# EAGLE design pico-pcm-cardem (EAGLE 7.7.0)
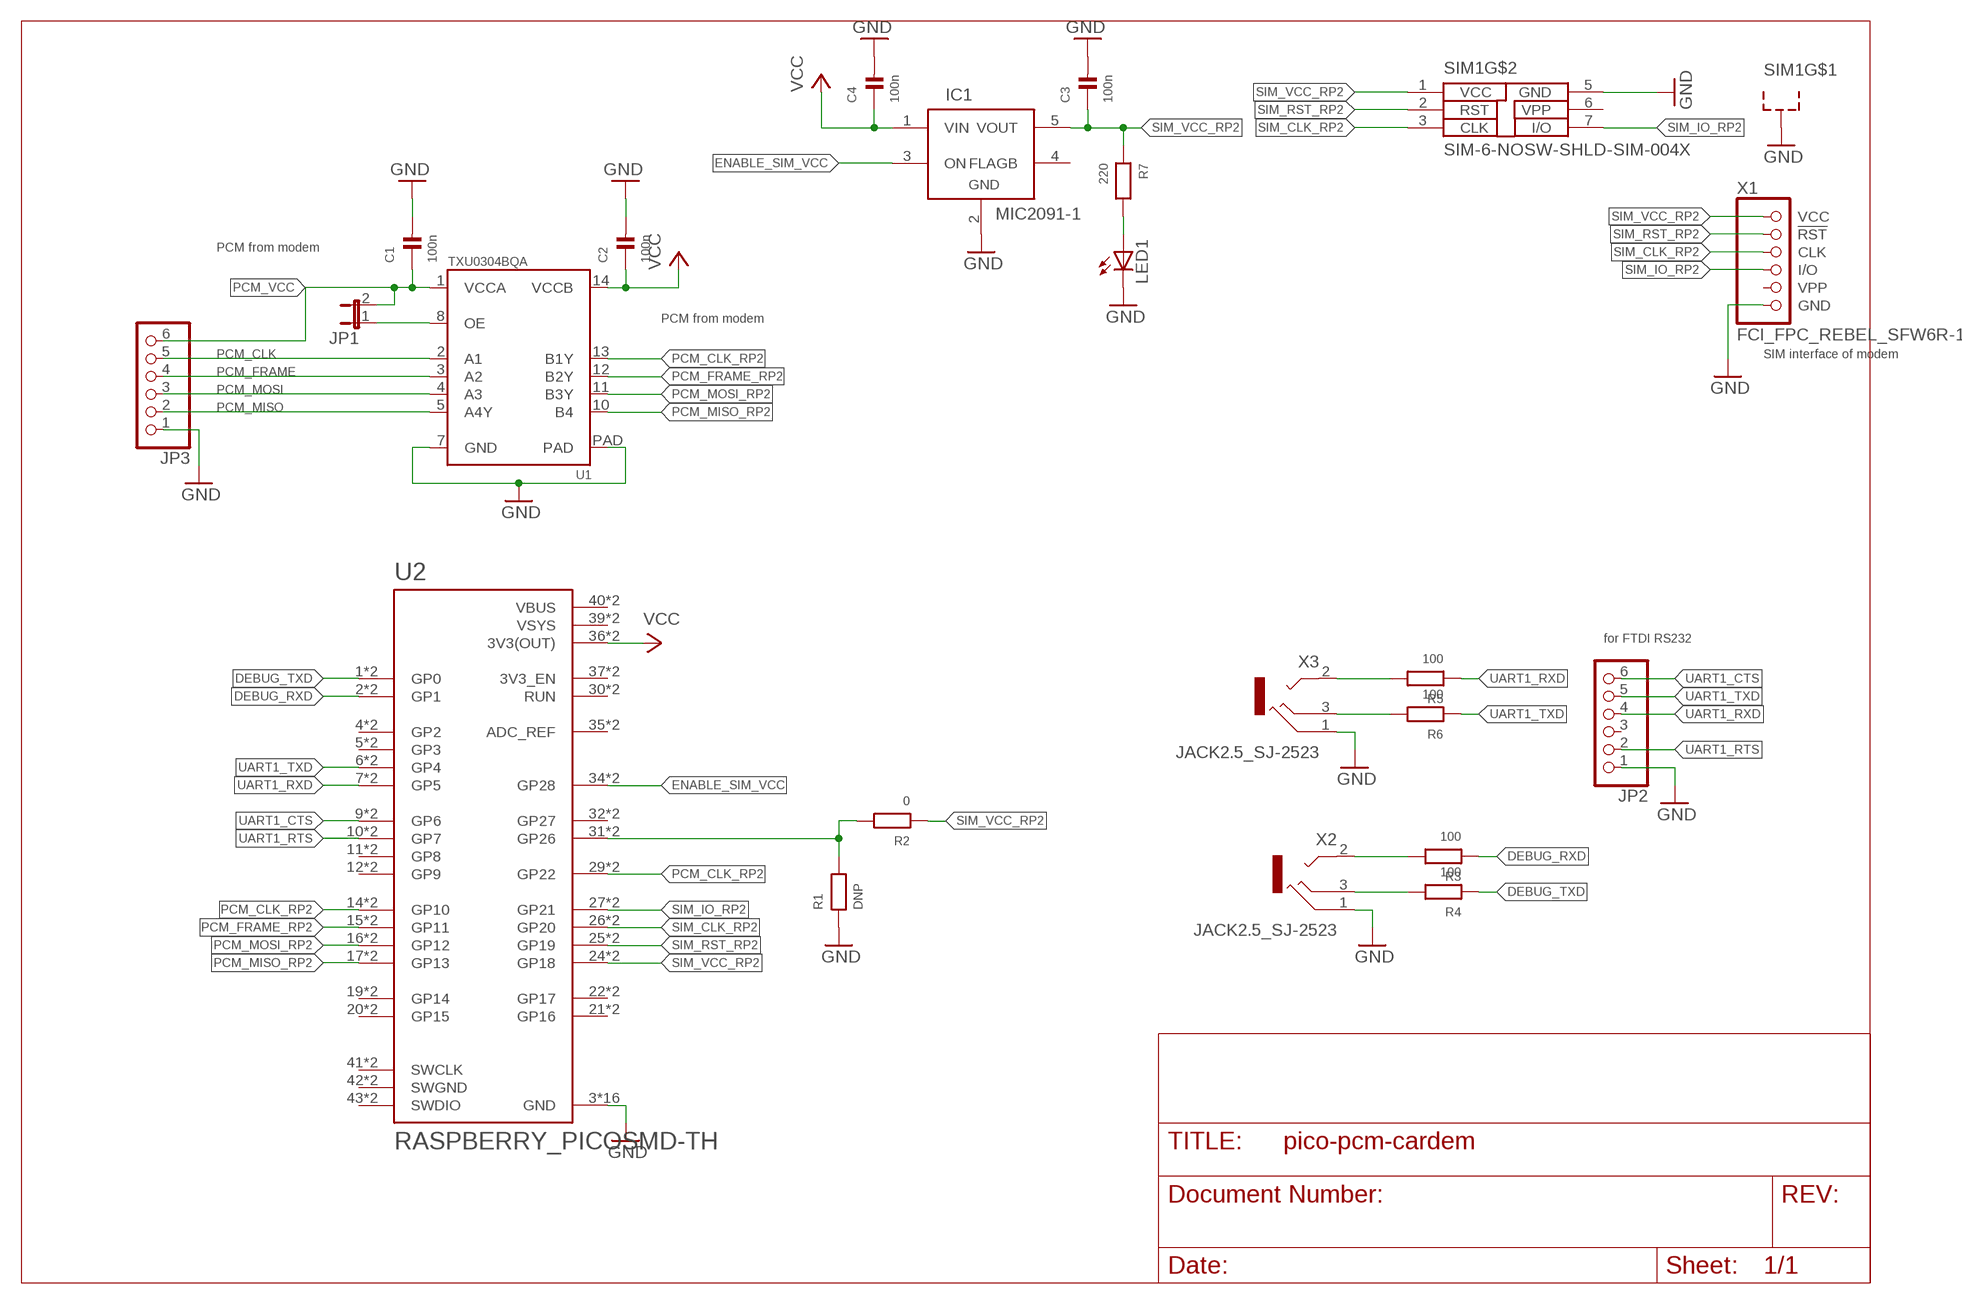
[diagram p0: schematic, sheet 1]

## Parts
C1  100n  CAP_CERAMIC_0603  [_0603]
C2  100n  CAP_CERAMIC_0603  [_0603]
C3  100n  CAP_CERAMIC_0603  [_0603]
C4  100n  CAP_CERAMIC_0603  [_0603]
IC1  MIC2091-1  FPF210X  [SOT23-5]
JP1  JP1E  [JP1]
JP2  PINHD-1X6  [1X06]
JP3  PINHD-1X6  [1X06]
LED1  LEDCHIP-LED0603  [CHIP-LED0603]
R1  DNP  RESISTOR_0603  [_0603]
R2  0  RESISTOR_0603  [_0603]
R3  100  RESISTOR_0603  [_0603]
R4  100  RESISTOR_0603  [_0603]
R5  100  RESISTOR_0603  [_0603]
R6  100  RESISTOR_0603  [_0603]
R7  220  RESISTOR_0603  [_0603]
SIM1  SIM-6-NOSW-SHLD-SIM-004X  [SOFNG_SIM-004X]
U1  TXU0304BQA  [14WQFN]
U2  RASPBERRY_PICOSMD-TH  [PICO-PKG]
X1  FCI_FPC_REBEL_SFW6R-1  [FPC_REBEL_SFW6R-1ST]
X2  JACK2.5_SJ-2523  [JACK2.5_SJ-2523]
X3  JACK2.5_SJ-2523  [JACK2.5_SJ-2523]

## Nets
DEBUG_RXD: R3.1 U2.2(GP1) U2.P$2(GP1)
DEBUG_TXD: R4.1 U2.1(GP0) U2.P$1(GP0)
ENABLE_SIM_VCC: IC1.3(ON) U2.34(GP28) U2.P$34(GP28)
GND: C1.2 C2.2 C3.2 C4.2 IC1.2(GND) JP2.1 JP3.1 LED1.C R1.1 SIM1.5(GND) SIM1.SHLD1(SHLD) SIM1.SHLD2(SHLD) SIM1.SHLD3(SHLD) SIM1.SHLD4(SHLD) U1.7(GND) U1.PAD U2.3(GND) U2.8(GND) U2.13(GND) U2.18(GND) U2.23(GND) U2.28(GND) U2.33(GND) U2.38(GND) U2.P$3(GND) U2.P$8(GND) U2.P$13(GND) U2.P$18(GND) U2.P$23(GND) U2.P$28(GND) U2.P$33(GND) U2.P$38(GND) X1.6(GND) X2.1(RING) X3.1(RING)
N$1: R3.2 X2.2(TIP)
N$2: JP1.1 U1.8(OE)
N$3: R1.2 R2.2 U2.31(GP26) U2.P$31(GP26)
N$4: R4.2 X2.3(MIDDLE)
N$5: R5.2 X3.2(TIP)
N$6: R6.2 X3.3(MIDDLE)
N$7: LED1.A R7.2
PCM_CLK: JP3.5 U1.2(A1)
PCM_CLK_RP2: U1.13(B1Y) U2.14(GP10) U2.29(GP22) U2.P$14(GP10) U2.P$29(GP22)
PCM_FRAME: JP3.4 U1.3(A2)
PCM_FRAME_RP2: U1.12(B2Y) U2.15(GP11) U2.P$15(GP11)
PCM_MISO: JP3.2 U1.5(A4Y)
PCM_MISO_RP2: U1.10(B4) U2.17(GP13) U2.P$17(GP13)
PCM_MOSI: JP3.3 U1.4(A3)
PCM_MOSI_RP2: U1.11(B3Y) U2.16(GP12) U2.P$16(GP12)
PCM_VCC: C1.1 JP1.2 JP3.6 U1.1(VCCA)
SIM_CLK_RP2: SIM1.3(CLK) U2.26(GP20) U2.P$26(GP20) X1.3(CLK)
SIM_IO_RP2: SIM1.7(I/O) U2.27(GP21) U2.P$27(GP21) X1.4(I/O)
SIM_RST_RP2: SIM1.2(RST) U2.25(GP19) U2.P$25(GP19) X1.2(!RST)
SIM_VCC_RP2: C3.1 IC1.5(VOUT) R2.1 R7.1 SIM1.1(VCC) U2.24(GP18) U2.P$24(GP18) X1.1(VCC)
UART1_CTS: JP2.6 U2.9(GP6) U2.P$9(GP6)
UART1_RTS: JP2.2 U2.10(GP7) U2.P$10(GP7)
UART1_RXD: JP2.4 R5.1 U2.7(GP5) U2.P$7(GP5)
UART1_TXD: JP2.5 R6.1 U2.6(GP4) U2.P$6(GP4)
VCC: C2.1 C4.1 IC1.1(VIN) U1.14(VCCB) U2.36(3V3(OUT)) U2.P$36(3V3(OUT))
Unconnected: IC1.4(FLAGB) JP2.3 U2.4(GP2) U2.5(GP3) U2.11(GP8) U2.12(GP9) U2.19(GP14) U2.20(GP15) U2.21(GP16) U2.22(GP17) U2.30(RUN) U2.32(GP27) U2.35(ADC_REF) U2.37(3V3_EN) U2.41(SWCLK) U2.43(SWDIO) U2.P$4(GP2) U2.P$5(GP3) U2.P$11(GP8) U2.P$12(GP9) U2.P$19(GP14) U2.P$20(GP15) U2.P$21(GP16) U2.P$22(GP17) U2.P$30(RUN) U2.P$32(GP27) U2.P$35(ADC_REF) U2.P$37(3V3_EN) U2.P$41(SWCLK) U2.P$43(SWDIO)

## Notes on the sheet
- PCM from modem
- PCM from modem
- SIM interface of modem
- for FTDI RS232

## Power pins joined to a net without a drawn wire
SWGND: U2.42(SWGND) U2.P$42(SWGND)
VBUS: U2.40(VBUS) U2.P$40(VBUS)
VPP: SIM1.6(VPP) X1.5(VPP)
VSYS: U2.39(VSYS) U2.P$39(VSYS)

## Library data of the parts
C1-C4 = rc-sysmocom:CAP_CERAMIC: Ceramic Capacitors 0402 - 0402 Surface Mount Capacitors 16pF 50V 5% [Digikey: 445-4899-2-ND] 18pF 50V 5% [Digikey: 490-1281-2-ND] 22pF 50V 5% [Digikey: 490-1283-2-ND] 68pF 50V 5% [Digikey: 490-1289-2-ND] 0.1uF 10V 10% [Digikey: 490-1318-2-ND] 1.0uF 6.3V 10% [Digikey: 490-1320-2-ND] 0603 - 0603 Surface Mount Capacitors 16 pF 50V 5% [Digikey: 445-5051-2-ND] 22 pF 50V [Digikey: PCC220ACVTR-ND] 33 pF 50V 5% [Digikey: 490-1415-1-ND] 56pF 50V 5% [Digikey: 490-1421-1-ND] 220pF 50V 5% [Digikey: 445-1285-1-ND] 680 pF 50V 2200 pF 50V 5% C0G [Digikey: 445-1297-1-ND] 5600 pF 100V 5% X7R [Digikey: 478-3711-1-ND] 0.1 µF 25V 10% [Digikey: PCC2277TR-ND] 0.22 µF 16V 10% X7R [Digikey: 445-1318-1-ND] 1.0 µF 25V 10% [Digikey: 445-5146-2-ND] 0603 - RF Specific 3pF 250V +/-0.1pF RF [Digikey: 712-1347-1-ND] 18 pF 250V 5% [Digikey: 478-3505-1-ND or 712-1322-1-ND] 56 pF 250V 5% C0G RF [Digikey: 490-4867-1-ND] 68 pF 250V RF [Digikey: 490-4868-1-ND] 0805 - 0805 Surface Mount Capacitors 220 pF 250V 2% RF Ceramic Capacitor [Digikey: 712-1398-1-ND] 1000 pF 50V 2% NP0 Ceramic Capacitor [Digikey: 478-3760-1-ND] 0.1 µF 25V 10% Ceramic Capacitor [Digikey: PCC1828TR-ND] 1.0 µF 16V 10% Ceramic Capacitor[Digikey: 490-1691-2-ND] 10.0 µF 10V 10% Ceramic Capacitor[Digikey: 709-1228-1-ND] 10.0 uF 16V 10% Ceramic Capacitor [Digikey: 478-5165-2-ND] 47 uF 6.3V 20% Ceramic Capacitor [Digikey: 587-1779-1-ND or 399-5506-1-ND] 1206 - 1206 Surface Mount Capacitors 47uF 10V 20% Ceramic Capacitor [Digikey: 490-5528-1-ND or 399-5508-1-ND or 445-6010-1-ND] 100uF 6.3V -20%, +80% Y5V Ceramic Capacitor (Digikey: 490-4512-1-ND, Mouser: 81-GRM31CF50J107ZE1L) 1810 - 1810 Surface Mount Capacitors High volt MLC; no solder stop between for higher isolation; CLASS: CAPACITOR; DESCRIPTION: NO DESCRIPTION; LINK: UNKNOWN LINK; MANUFACTURER: UNKNOWN MANUFACTURER; MANUFACTURERPARTNUMBER: UNKNOWN MANUFACTURER PART NUMBER; POPULATED: TRUE; ROHSCERTIFICATE: UNKNOWN ROHS CERTIFICATE; SOURCE: UNKNOWN SOURCE; SOURCEPARTNUMBER: UNKNOWN SOURCE PART NUMBER
IC1 = FPF2x0x:FPF210X: FPF2100-FPF2107 IntelliMAX Advanced Load Management Products; CLASS: UNKNOWN CLASS; DESCRIPTION: NO DESCRIPTION; LINK: https://www.digikey.de/en/products/detail/microchip-technology/MIC2091-1YM5-TR/2650461; MANUFACTURER: UNKNOWN MANUFACTURER; MANUFACTURERPARTNUMBER: https://www.digikey.de/en/products/detail/microchip-technology/MIC2091-1YM5-TR/2650461; POPULATED: TRUE; ROHSCERTIFICATE: UNKNOWN ROHS CERTIFICATE; SOURCE: UNKNOWN SOURCE; SOURCEPARTNUMBER: 576-3891-1-ND
JP1 = jumper:JP1E: JUMPER; CLASS: CONNECTOR\JUMPER; DESCRIPTION: NO DESCRIPTION; LINK: UNKNOWN LINK; MANUFACTURER: UNKNOWN MANUFACTURER; MANUFACTURERPARTNUMBER: UNKNOWN MANUFACTURER PART NUMBER; POPULATED: TRUE; ROHSCERTIFICATE: UNKNOWN ROHS CERTIFICATE; SOURCE: UNKNOWN SOURCE; SOURCEPARTNUMBER: UNKNOWN SOURCE PART NUMBER
JP2 JP3 = pinhead:PINHD-1X6: PIN HEADER; CLASS: CONNECTOR\JUMPER; DESCRIPTION: NO DESCRIPTION; LINK: UNKNOWN LINK; MANUFACTURER: UNKNOWN MANUFACTURER; MANUFACTURERPARTNUMBER: UNKNOWN MANUFACTURER PART NUMBER; POPULATED: TRUE; ROHSCERTIFICATE: UNKNOWN ROHS CERTIFICATE; SOURCE: UNKNOWN SOURCE; SOURCEPARTNUMBER: UNKNOWN SOURCE PART NUMBER
LED1 = led:LED: LED OSRAM: - CHIPLED LG R971, LG N971, LY N971, LG Q971, LY Q971, LO R971, LY R971 LH N974, LH R974 LS Q976, LO Q976, LY Q976 LO Q996 - Hyper CHIPLED LW Q18S LB Q993, LB Q99A, LB R99A - SideLED LS A670, LO A670, LY A670, LG A670, LP A670 LB A673, LV A673, LT A673, LW A673 LH A674 LY A675 LS A676, LA A676, LO A676, LY A676, LW A676 LS A679, LY A679, LG A679 - Hyper Micro SIDELED® LS Y876, LA Y876, LO Y876, LY Y876 LT Y87S - SmartLED LW L88C, LW L88S LB L89C, LB L89S, LG L890 LS L89K, LO L89K, LY L89K LS L896, LA L896, LO L896, LY L896 - TOPLED LS T670, LO T670, LY T670, LG T670, LP T670 LSG T670, LSP T670, LSY T670, LOP T670, LYG T670 LG T671, LOG T671, LSG T671 LB T673, LV T673, LT T673, LW T673 LH T674 LS T676, LA T676, LO T676, LY T676, LB T676, LH T676, LSB T676, LW T676 LB T67C, LV T67C, LT T67C, LS T67K, LO T67K, LY T67K, LW E67C LS E67B, LA E67B, LO E67B, LY E67B, LB E67C, LV E67C, LT E67C LW T67C LS T679, LY T679, LG T679 LS T770, LO T770, LY T770, LG T770, LP T770 LB T773, LV T773, LT T773, LW T773 LH T774 LS E675, LA E675, LY E675, LS T675 LS T776, LA T776, LO T776, LY T776, LB T776 LHGB T686 LT T68C, LB T68C - Hyper Mini TOPLED® LB M676 - Mini TOPLED Santana® LG M470 LS M47K, LO M47K, LY M47K Source: http://www.osram.convergy.de LUXEON: - LUMILED® LXK2-PW12-R00, LXK2-PW12-S00, LXK2-PW14-U00, LXK2-PW14-V00 LXK2-PM12-R00, LXK2-PM12-S00, LXK2-PM14-U00 LXK2-PE12-Q00, LXK2-PE12-R00, LXK2-PE12-S00, LXK2-PE14-T00, LXK2-PE14-U00 LXK2-PB12-K00, LXK2-PB12-L00, LXK2-PB12-M00, LXK2-PB14-N00, LXK2-PB14-P00, LXK2-PB14-Q00 LXK2-PR12-L00, LXK2-PR12-M00, LXK2-PR14-Q00, LXK2-PR14-R00 LXK2-PD12-Q00, LXK2-PD12-R00, LXK2-PD12-S00 LXK2-PH12-R00, LXK2-PH12-S00 LXK2-PL12-P00, LXK2-PL12-Q00, LXK2-PL12-R00 Source: www.luxeon.com KINGBRIGHT: KA-3528ASYC Source: www.kingbright.com; CLASS: LED; DESCRIPTION: NO DESCRIPTION; LINK: UNKNOWN LINK; MANUFACTURER: UNKNOWN MANUFACTURER; MANUFACTURERPARTNUMBER: UNKNOWN MANUFACTURER PART NUMBER; POPULATED: TRUE; ROHSCERTIFICATE: UNKNOWN ROHS CERTIFICATE; SOURCE: UNKNOWN SOURCE; SOURCEPARTNUMBER: UNKNOWN SOURCE PART NUMBER
R1-R7 = rc-sysmocom:RESISTOR: Resistors 0402 - 0402 Surface Mount Package 22 Ohm 1% 1/16W [Digikey: 311-22.0LRTR-ND] 33 Ohm 5% 1/16W 1.0K 5% 1/16W 1.5K 5% 1/16W 2.0K 1% 1/16W 10.0K 1% 1/16W [Digikey: 311-10.0KLRTR-ND] 10.0K 5% 1/16W [Digikey: RMCF0402JT10K0TR-ND] 12.1K 1% 1/16W [Digikey: 311-22.0LRTR-ND] 100.0K 5% 1/16W 0603 - 0603 Surface Mount Package 1/10 Watt 0805 - 0805 Surface Mount Package 1/8 Watt 1206 - 1206 Surface Mount Package 2012 - 2010 Surface Mount Package 0.11 Ohm 1/2 Watt 1% Resistor - Digikey: RHM.11UCT-ND; CLASS: RESISTOR; DESCRIPTION: NO DESCRIPTION; LINK: UNKNOWN LINK; MANUFACTURER: UNKNOWN MANUFACTURER; MANUFACTURERPARTNUMBER: UNKNOWN MANUFACTURER PART NUMBER; POPULATED: TRUE; ROHSCERTIFICATE: UNKNOWN ROHS CERTIFICATE; SOURCE: UNKNOWN SOURCE; SOURCEPARTNUMBER: UNKNOWN SOURCE PART NUMBER
SIM1 = SIM-Amphenol:SIM-6-NOSW-SHLD: SIM card holder, 6 pins, no switch. with shield pad[s]; CLASS: UNKNOWN CLASS; DESCRIPTION: NO DESCRIPTION; LINK: UNKNOWN LINK; MANUFACTURER: UNKNOWN MANUFACTURER; MANUFACTURERPARTNUMBER: UNKNOWN MANUFACTURER PART NUMBER; POPULATED: TRUE; ROHSCERTIFICATE: UNKNOWN ROHS CERTIFICATE; SOURCE: UNKNOWN SOURCE; SOURCEPARTNUMBER: UNKNOWN SOURCE PART NUMBER
U1 = level-shifter:TXU0304: TXU0304 4-Bit Fixed Direction Voltage-Level Translator with Schmitt-Trigger Inputs and 3-State Outputs; CLASS: IC; DESCRIPTION: NO DESCRIPTION; LINK: https://www.digikey.de/en/products/detail/texas-instruments/TXU0304BQAR/14641429; MANUFACTURER: UNKNOWN MANUFACTURER; MANUFACTURERPARTNUMBER: TXU0304BQAR; POPULATED: TRUE; ROHSCERTIFICATE: UNKNOWN ROHS CERTIFICATE; SOURCE: UNKNOWN SOURCE; SOURCEPARTNUMBER: 296-TXU0304BQARCT-ND
U2 = RpiPico:RASPBERRY_PICO: Raspberry Pi Pico; CLASS: IC; DESCRIPTION: NO DESCRIPTION; LINK: https://www.digikey.de/en/products/detail/raspberry-pi/SC0915/13624793; MANUFACTURER: UNKNOWN MANUFACTURER; MANUFACTURERPARTNUMBER: UNKNOWN MANUFACTURER PART NUMBER; POPULATED: TRUE; ROHSCERTIFICATE: UNKNOWN ROHS CERTIFICATE; SOURCE: UNKNOWN SOURCE; SOURCEPARTNUMBER: 2648-SC0915CT-ND
X1 = laforge:FCI_FPC_REBEL_SFW6R-1; CLASS: CONNECTOR; DESCRIPTION: NO DESCRIPTION; LINK: https://www.digikey.de/en/products/detail/amphenol-cs-fci/SFW6R-1STE1LF/1002204; MANUFACTURER: UNKNOWN MANUFACTURER; MANUFACTURERPARTNUMBER: SFW6R-1STE1LF; OC_DIGIKEY: 609-1889-1-ND; POPULATED: TRUE; ROHSCERTIFICATE: UNKNOWN ROHS CERTIFICATE; SOURCE: UNKNOWN SOURCE; SOURCEPARTNUMBER: 609-1889-1-ND
X2 = laforge:JACK2.5_SJ-2523: CUI Inc. SJ-2523-SMT; CLASS: CONNECTOR; DESCRIPTION: NO DESCRIPTION; LINK: UNKNOWN LINK; MANUFACTURER: UNKNOWN MANUFACTURER; MANUFACTURERPARTNUMBER: UNKNOWN MANUFACTURER PART NUMBER; OC_DIGIKEY: CP-2523SJCT-ND; POPULATED: TRUE; ROHSCERTIFICATE: UNKNOWN ROHS CERTIFICATE; SOURCE: UNKNOWN SOURCE; SOURCEPARTNUMBER: UNKNOWN SOURCE PART NUMBER
X3 = laforge:JACK2.5_SJ-2523: CUI Inc. SJ-2523-SMT; CLASS: CONNECTOR; DESCRIPTION: NO DESCRIPTION; LINK: https://www.digikey.de/en/products/detail/cui-devices/SJ-2523-SMT-TR/281300; MANUFACTURER: UNKNOWN MANUFACTURER; MANUFACTURERPARTNUMBER: SJ-2523-SMT-TR; OC_DIGIKEY: CP-2523SJCT-ND; POPULATED: TRUE; ROHSCERTIFICATE: UNKNOWN ROHS CERTIFICATE; SOURCE: UNKNOWN SOURCE; SOURCEPARTNUMBER: CP-2523SJCT-ND

## Board
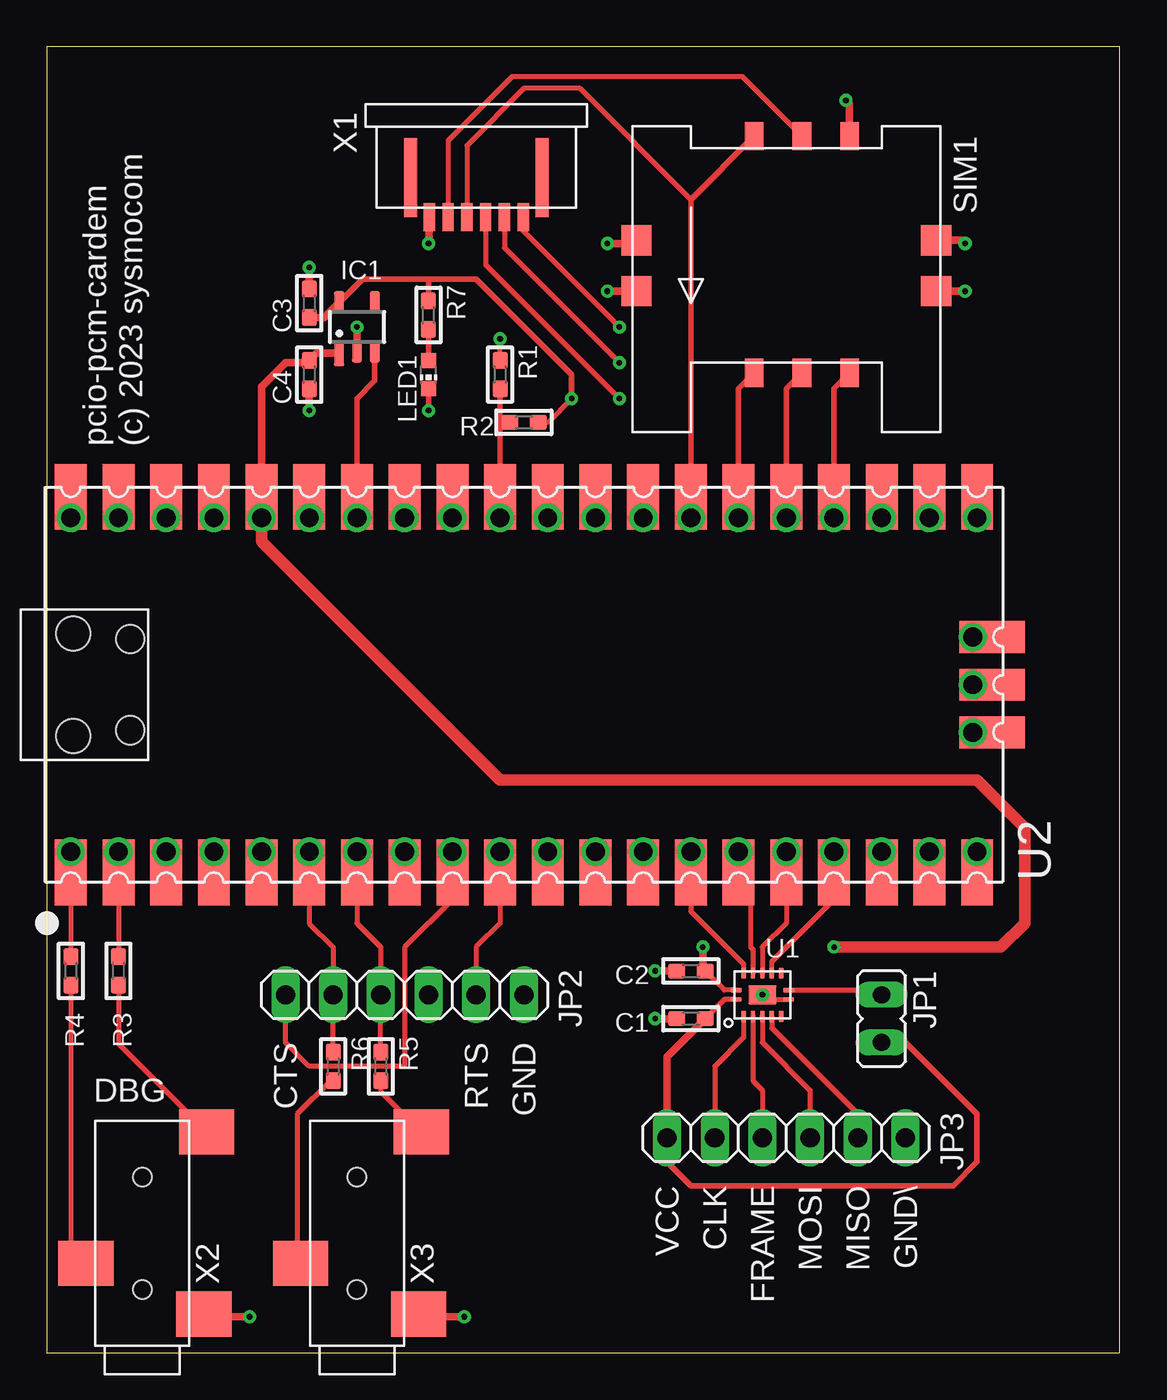
[diagram p1: board, top side]
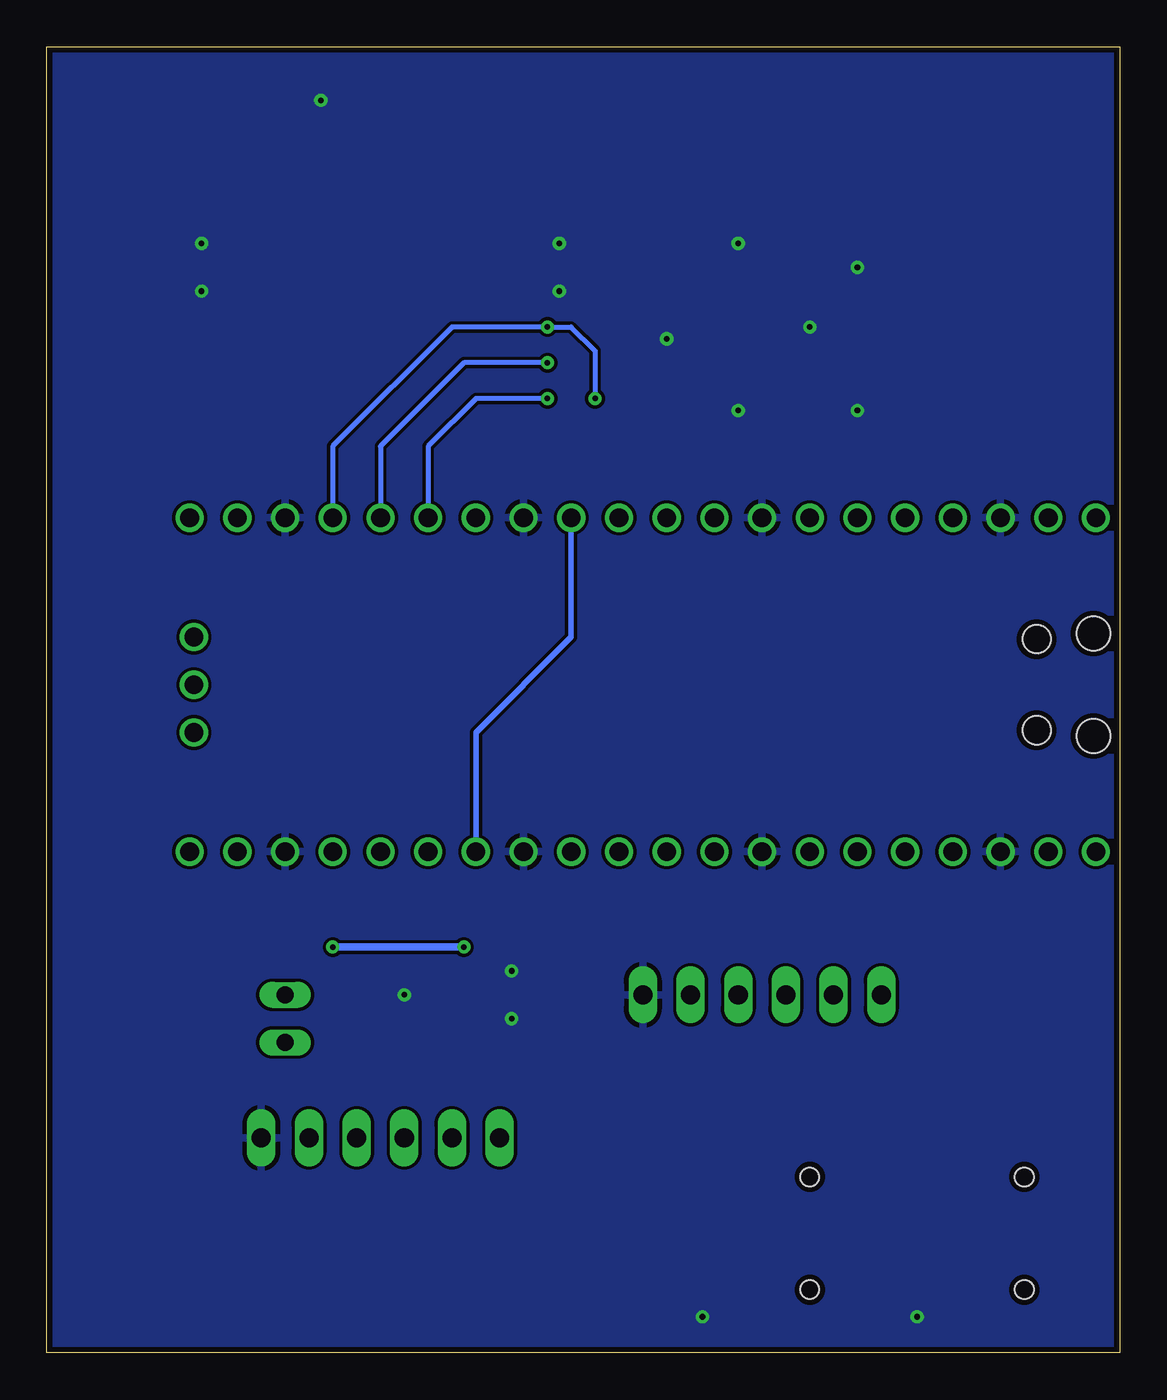
[diagram p2: board, bottom side, seen from below]

Size 57.13 x 69.52 mm. Coordinates in mm from the lower left corner, seen from the top.
Outline: 0,0 57.13,0 57.13,69.52 0,69.52 0,0
Copper layers (1*16): Top 0.035mm / dielectric 1.5mm / Bottom 0.035mm
Design rules "aisler_2_layer_simple": minimum track width 0.2mm, minimum drill 0.45mm, track to track 0.175mm, track to pad 0.175mm, pad to pad 0.175mm, via to via 0.175mm, smd to smd 0.175mm, copper to edge 0.3mm, drill to drill 0.25mm, minimum pad ring 0.2mm, minimum via ring 0.2mm, stop-mask expansion 0mil, vias tented up to drill 0mil, thermal gap 10mil

### Footprints (pad centres in the part's own frame; a part is rotated, then mirrored left to right if it is on the bottom)
_0603 = smd 0.9 x 0.8: 1 -0.762,0; 2 0.762,0
SOT23-5 = smd 0.55 x 1.4: 1 -0.95,-1.4 | smd 0.55 x 1.2: 2 0,-1.3; 3 0.95,-1.3; 4 0.95,1.3; 5 -0.95,1.3
JP1 = drill 0.914 long: 1 0,-1.27; 2 0,1.27
1X06 = drill 1.016 long: 1 -6.35,0; 2 -3.81,0; 3 -1.27,0; 4 1.27,0; 5 3.81,0; 6 6.35,0
CHIP-LED0603 = smd 0.8 x 0.8: A 0,-0.75; C 0,0.75
SOFNG_SIM-004X = smd 1 x 1.5: 1 -3.37,4.98; 2 -0.83,4.98; 3 1.71,4.98; 5 -3.37,-7.62; 6 -0.83,-7.62; 7 1.71,-7.62 | smd 1.6 x 1.6: SHLD1 -7.98,0.63; SHLD2 -7.98,-2.07; SHLD3 7.98,0.63; SHLD4 7.98,-2.07
14WQFN = smd 0.25 x 0.6: 1 -0.25,1.4; 7 -0.25,-1.4; 8 0.25,-1.4; 14 0.25,1.4 | smd 0.6 x 0.25: 2 -1.15,1; 3 -1.15,0.5; 4 -1.15,0; 5 -1.15,-0.5; 6 -1.15,-1; 9 1.15,-1; 10 1.15,-0.5; 11 1.15,0; 12 1.15,0.5; 13 1.15,1 | smd 1 x 1.5: PAD 0,0
PICO-PKG = drill 1: 1 -8.89,24.13; 2 -8.89,21.59; 3 -8.89,19.05; 4 -8.89,16.51; 5 -8.89,13.97; 6 -8.89,11.43; 7 -8.89,8.89; 8 -8.89,6.35; 9 -8.89,3.81; 10 -8.89,1.27; 11 -8.89,-1.27; 12 -8.89,-3.81; 13 -8.89,-6.35; 14 -8.89,-8.89; 15 -8.89,-11.43; 16 -8.89,-13.97; 17 -8.89,-16.51; 18 -8.89,-19.05; 19 -8.89,-21.59; 20 -8.89,-24.13; 21 8.89,-24.13; 22 8.89,-21.59; 23 8.89,-19.05; 24 8.89,-16.51; 25 8.89,-13.97; 26 8.89,-11.43; 27 8.89,-8.89; 28 8.89,-6.35; 29 8.89,-3.81; 30 8.89,-1.27; 31 8.89,1.27; 32 8.89,3.81; 33 8.89,6.35; 34 8.89,8.89; 35 8.89,11.43; 36 8.89,13.97; 37 8.89,16.51; 38 8.89,19.05; 39 8.89,21.59; 40 8.89,24.13; 41 -2.54,-23.9; 42 0,-23.9; 43 2.54,-23.9 | smd 3.5 x 1.7: P$1 -10,24.13; P$2 -10,21.59; P$3 -10,19.05; P$4 -10,16.51; P$5 -10,13.97; P$6 -10,11.43; P$7 -10,8.89; P$8 -10,6.35; P$9 -10,3.81; P$10 -10,1.27; P$11 -10,-1.27; P$12 -10,-3.81; P$13 -10,-6.35; P$14 -10,-8.89; P$15 -10,-11.43; P$16 -10,-13.97; P$17 -10,-16.51; P$18 -10,-19.05; P$19 -10,-21.59; P$20 -10,-24.13; P$21 10,-24.13; P$22 10,-21.59; P$23 10,-19.05; P$24 10,-16.51; P$25 10,-13.97; P$26 10,-11.43; P$27 10,-8.89; P$28 10,-6.35; P$29 10,-3.81; P$30 10,-1.27; P$31 10,1.27; P$32 10,3.81; P$33 10,6.35; P$34 10,8.89; P$35 10,11.43; P$36 10,13.97; P$37 10,16.51; P$38 10,19.05; P$39 10,21.59; P$40 10,24.13 | smd 1.7 x 3.5: P$41 -2.54,-24.925; P$42 0,-24.925; P$43 2.54,-24.925 | hole 1.8: -2.725,24; 2.725,24 | hole 1.5: -2.425,20.97; 2.425,20.97
FPC_REBEL_SFW6R-1ST = smd 0.6 x 1.5: 1 -2.5,0.5; 2 -1.5,0.5; 3 -0.5,0.5; 4 0.5,0.5; 5 1.5,0.5; 6 2.5,0.5 | smd 0.7 x 4.2: M1 -3.5,-1.6; M2 3.5,-1.6
JACK2.5_SJ-2523 = smd 2.4 x 2.94: 1 -4.3,-3.274; 2 5.4,-3.424; 3 -1.6,3 | hole 1: -3,0; 3,0

### Placement (x,y rotation side)
C1  34.29,17.78 180 top
C2  34.29,20.32 180 top
C3  13.97,55.88 90 top
C4  13.97,52.07 270 top
IC1  16.51,54.61 0 top
JP1  44.45,17.78 180 top
JP2  19.05,19.05 180 top
JP3  39.37,11.43 180 top
LED1  20.32,52.07 180 top
R1  24.13,52.07 270 top
R2  25.4,49.53 180 top
R3  3.81,20.32 270 top
R4  1.27,20.32 270 top
R5  17.78,15.24 270 top
R6  15.24,15.24 270 top
R7  20.32,55.24 270 top
SIM1  39.37,57.15 180 top
U1  38.1,19.05 90 top
U2  25.4,35.56 90 top
X1  22.86,60.96 180 top
X2  5.08,6.35 90 top
X3  16.51,6.35 90 top

### Tracks (layer width: path | path; a pad name or v marks a point on that pad's centre or on a via)
DEBUG_RXD
  Top 0.254: U2.2 U2.P$2 | 3.81,25.4 U2.P$2 | U2.P$2 R3.1
DEBUG_TXD
  Top 0.254: U2.1 U2.P$1 | 1.27,24.13 U2.P$1 | U2.P$1 R4.1
ENABLE_SIM_VCC
  Top 0.254: U2.34 U2.P$34
  Top 0.305: IC1.3 17.46,51.75 16.51,50.8 16.51,45.72 U2.P$34
GND  (via drill 0.3)
  Top 0.254: U2.33 U2.P$33 | U2.38 U2.P$38 6.35,45.72 | U2.3 U2.P$3 | U2.P$8 U2.8 | U2.13 U2.P$13 | U2.18 U2.P$18 | U2.28 U2.P$28 | R1.1 v24.13,53.98 | U1.PAD 38.35,18.8 U1.7 | U2.P$23 U2.23
  Top 0.305: LED1.C v20.32,50.16
  Top 0.406: C2.2 v32.38,20.32 | C1.2 v32.38,17.78 | X3.1 19.93,1.91 v22.23,1.91 | X2.1 8.5,1.91 v10.79,1.91 | SIM1.5 42.74,66.48 v42.55,66.67 | SIM1.SHLD2 48.73,59.22 v48.9,59.05 | SIM1.SHLD1 v48.89,56.52 v48.9,56.52 | v29.84,56.52 SIM1.SHLD3 | v29.84,59.05 31.23,59.05 SIM1.SHLD4 | IC1.2 v16.51,54.61 | C3.2 v13.97,57.78 | C4.2 v13.97,50.16 | X1.6 20.36,59.09 v20.32,59.05
  other vias: 38.1,19.05
  pour Bottom: 0,0 0,69.85 57.15,69.85 57.15,0
N$1
  Top 0.254: R3.2 3.81,16.44 X2.2
N$2
  Top 0.254: U1.8 44.2,19.3 JP1.1
N$3
  Top 0.254: U2.31 U2.P$31 | R2.2 24.13,49.53
  Top 0.305: U2.P$31 24.13,49.53 R1.2
N$4
  Top 0.254: R4.2 1.27,5.56 X2.3
N$5
  Top 0.254: R5.2 17.78,13.9 X3.2
N$6
  Top 0.254: R6.2 15.11,14.48 13.34,12.7 13.34,4.92 X3.3
N$7
  Top 0.305: R7.2 LED1.A
PCM_CLK
  Top 0.254: U1.2 37.1,16.78 35.56,15.24 JP3.5
PCM_CLK_RP2
  Top 0.254: U2.29 U2.P$29 | U2.14 U2.P$14 34.29,23.5 37.1,20.68 U1.13
  Bottom 0.305: U2.14 34.29,33.02 29.21,38.1 U2.29
PCM_FRAME
  Top 0.254: U1.3 37.6,14.47 38.1,13.97 JP3.4
PCM_FRAME_RP2
  Top 0.254: U2.15 U2.P$15 37.47,24.93 37.47,21.59 37.6,21.45 U1.12
PCM_MISO
  Top 0.254: U1.5 38.6,17.28 43.18,12.7 JP3.2
PCM_MISO_RP2
  Top 0.254: U2.17 U2.P$17 41.91,24.13 38.6,20.82 U1.10
PCM_MOSI
  Top 0.254: U1.4 38.1,16.51 40.64,13.97 JP3.3
PCM_MOSI_RP2
  Top 0.254: U2.16 U2.P$16 39.37,22.86 38.1,21.59 U1.11
PCM_VCC
  Top 0.254: U1.1 36.07,18.8 C1.1
  Top 0.305: JP1.2 45.72,16.51 49.53,12.7 49.53,10.16 48.26,8.89 34.29,8.89 33.02,10.16 JP3.6
  Top 0.406: C1.1 33.02,15.75 JP3.6
SIM_CLK_RP2  (via drill 0.3)
  Top 0.254: U2.26 U2.P$26 | X1.3 23.36,57.92 v30.48,50.8
  Top 0.305: U2.P$26 36.83,51.34 SIM1.3
  Bottom 0.254: v30.48,50.8 34.29,50.8 36.83,48.26 U2.26
SIM_IO_RP2
  Top 0.254: U2.P$27 U2.27 | 34.29,61.4 28.38,67.31 25.4,67.31 22.36,64.27 X1.4
  Top 0.305: SIM1.7 34.29,61.4 U2.P$27
SIM_RST_RP2  (via drill 0.3)
  Top 0.254: U2.25 U2.P$25 | X1.2 24.36,58.83 v30.48,52.7
  Top 0.305: U2.P$25 39.37,51.34 SIM1.2
  Bottom 0.254: v30.48,52.7 34.92,52.7 39.37,48.26 U2.25
SIM_VCC_RP2  (via drill 0.3)
  Top 0.254: U2.24 U2.P$24 | X1.1 25.36,59.73 v30.48,54.61 | v27.94,50.8 26.67,49.53 R2.1
  Top 0.305: U2.P$24 41.91,51.34 SIM1.1 | IC1.5 16.8,57.15 20.32,57.15 | 20.32,57.15 22.86,57.15 27.94,52.07 v27.94,50.8 | R7.1 20.32,57.15
  Top 0.406: IC1.5 14.77,55.12 C3.1
  Bottom 0.254: U2.24 41.91,48.26 35.56,54.61 v30.48,54.61 29.21,54.61 27.94,53.34 v27.94,50.8
SWGND
  Top 0.254: U2.42 U2.P$42
UART1_CTS
  Top 0.254: U2.9 U2.P$9 21.59,24.13 19.05,21.59 19.05,15.24 13.97,15.24 12.7,16.51 JP2.6
UART1_RTS
  Top 0.254: U2.10 U2.P$10 24.13,22.86 22.86,21.59 JP2.2
UART1_RXD
  Top 0.254: U2.7 U2.P$7 16.51,22.86 17.78,21.59 JP2.4 R5.1
UART1_TXD
  Top 0.254: R6.1 JP2.5 15.24,21.59 13.97,22.86 U2.P$6 U2.6
VBUS
  Top 0.254: U2.P$40 U2.40
VCC  (via drill 0.3)
  Top 0.254: U2.36 U2.P$36 | U1.14 36.07,19.3 C2.1
  Top 0.406: IC1.1 14.35,53.21 C4.1 13.84,52.7 12.7,52.7 11.43,51.44 U2.P$36 | v34.92,21.59 34.92,20.45 C2.1
  Top 0.61: U2.36 11.43,43.18 24.13,30.48 49.53,30.48 52.07,27.94 52.07,22.86 50.8,21.59 v41.91,21.59
  Bottom 0.406: v41.91,21.59 v34.92,21.59
VPP
  Top 0.254: SIM1.6 37.02,67.94 24.77,67.94 21.36,64.54 X1.5
VSYS
  Top 0.254: U2.39 U2.P$39

### Text on the board
tPlace: pcio-pcm-cardem / (c) 2023 sysmocom
tNames: CTS | RTS | GND | DBG | VCC | CLK | FRAME | MOSI | MISO | GND\